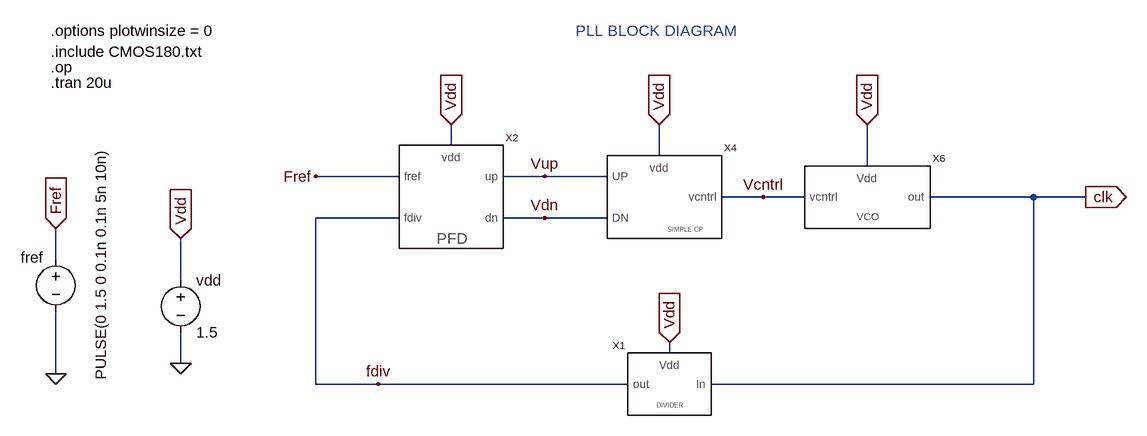
[diagram p0: schematic PLL_Complete.asc]
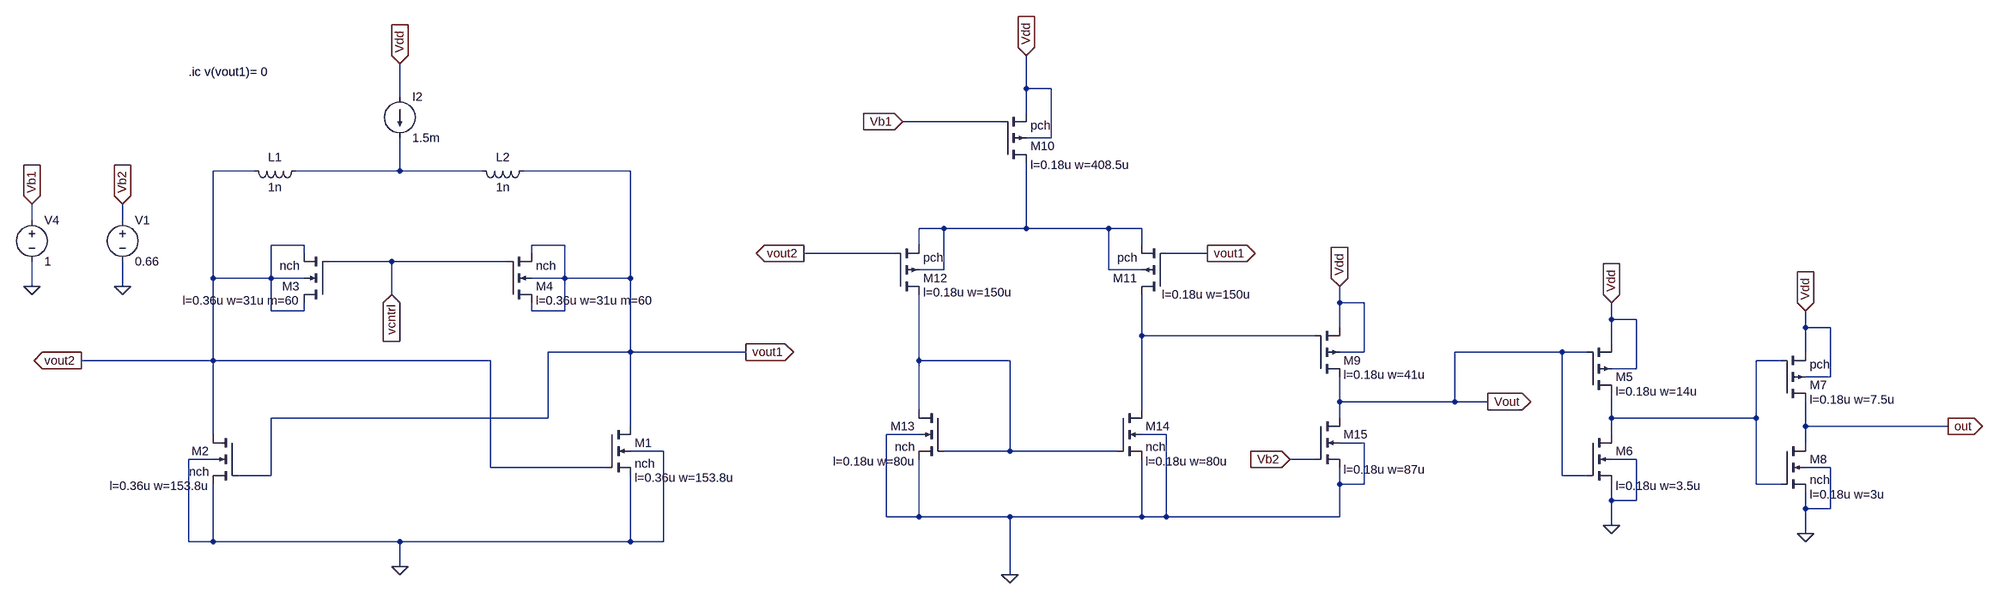
[diagram p1: sub-circuit vco_sym.asc]
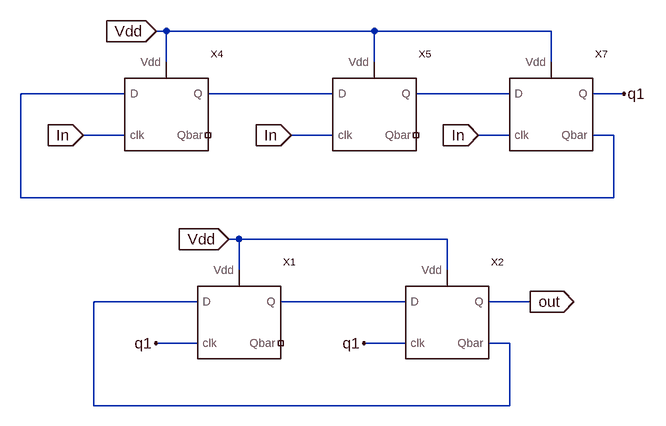
[diagram p2: sub-circuit divider_sym.asc]
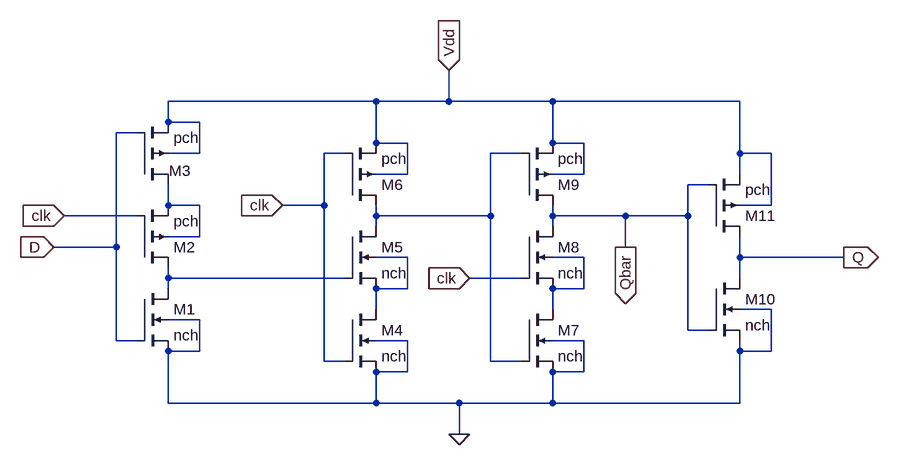
[diagram p3: sub-circuit dff_sym.asc]
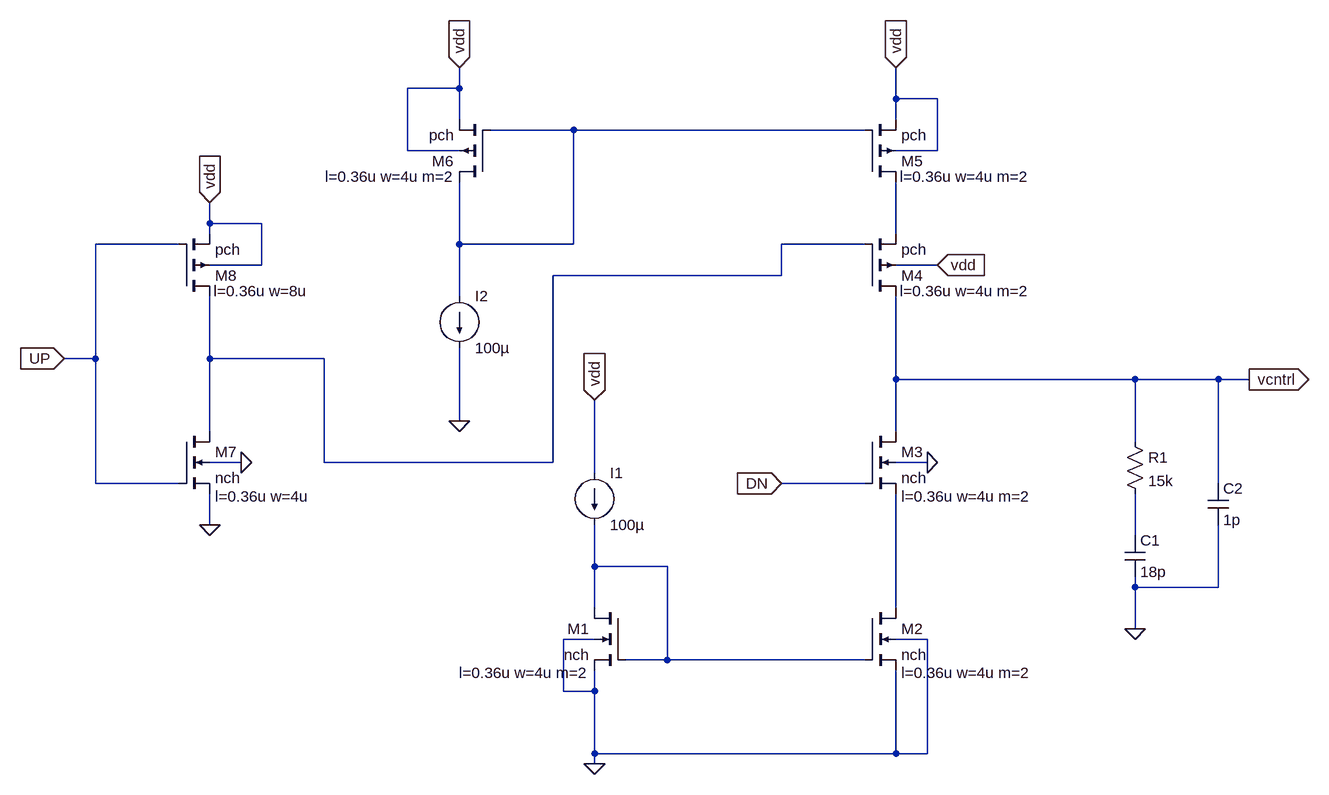
[diagram p4: sub-circuit simple_cp_sym.asc]
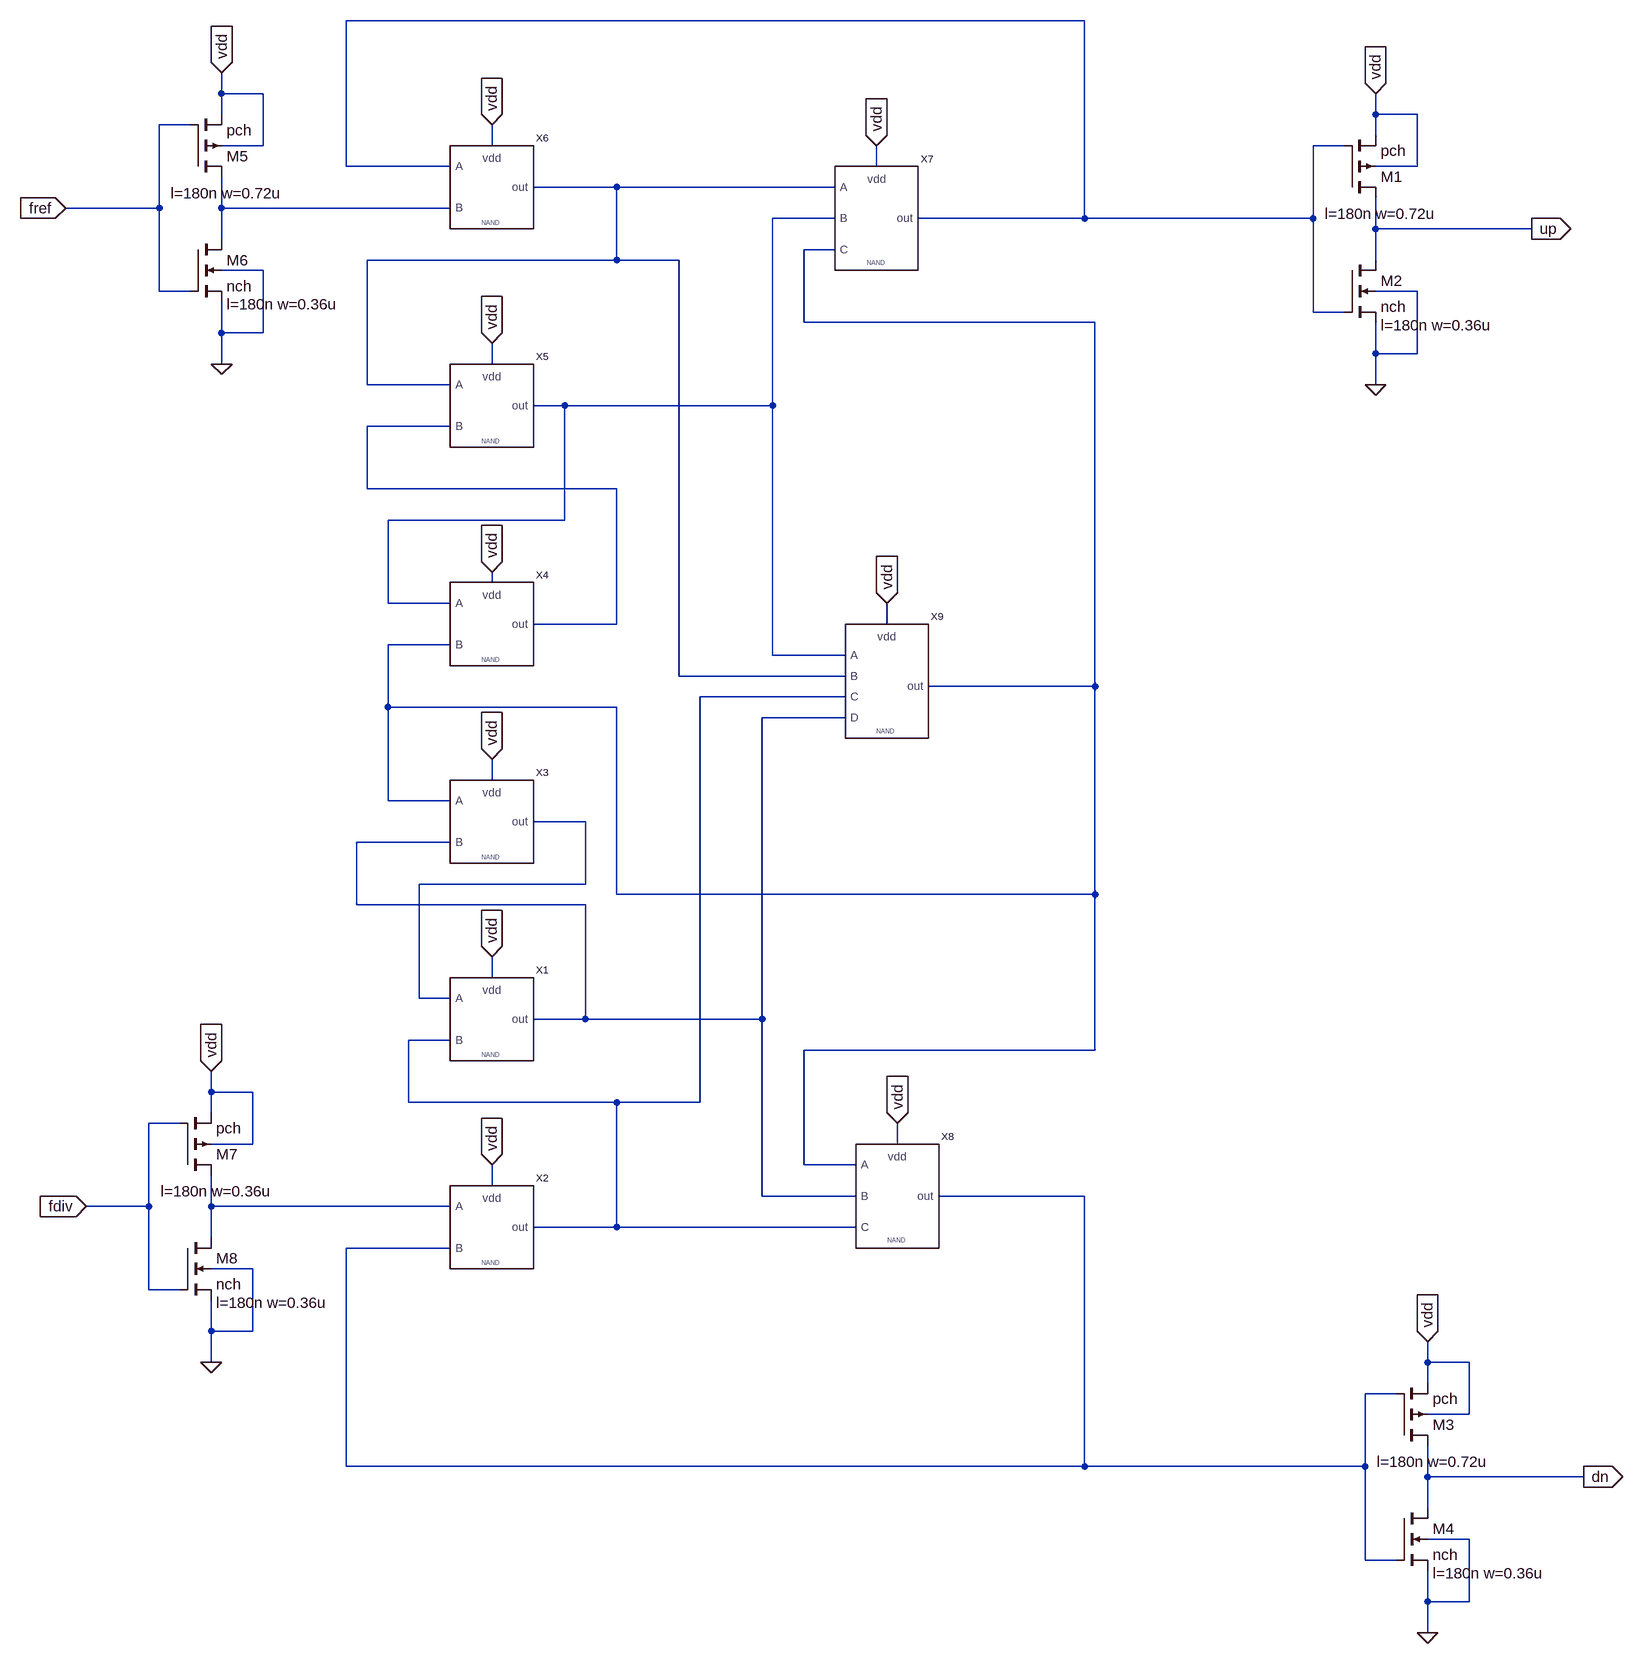
[diagram p5: sub-circuit pfd_nand.asc]
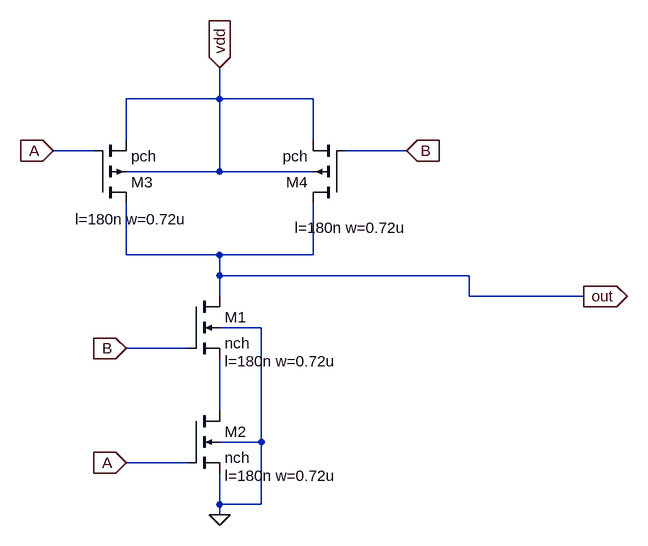
[diagram p6: sub-circuit nand_2.asc]
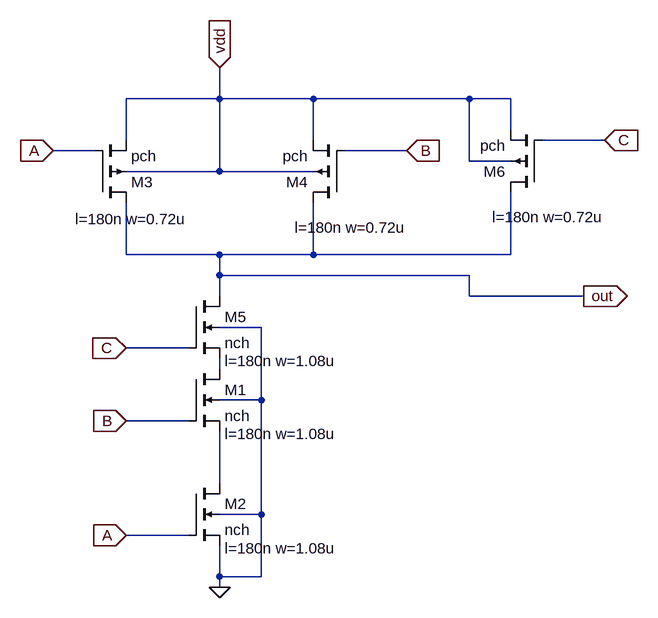
[diagram p7: sub-circuit nand_3.asc]
PLL_Complete.asc, the LTspice schematic file:
Version 4
SHEET 1 5428 1300
WIRE 592 -1072 592 -1104
WIRE 912 -1056 912 -1104
WIRE 1232 -1040 1232 -1104
WIRE 512 -1024 384 -1024
WIRE 736 -1024 672 -1024
WIRE 832 -1024 736 -1024
WIRE 1072 -992 1008 -992
WIRE 1136 -992 1072 -992
WIRE 1488 -992 1328 -992
WIRE 1568 -992 1488 -992
WIRE 512 -960 384 -960
WIRE 736 -960 672 -960
WIRE 832 -960 736 -960
WIRE -16 -896 -16 -944
WIRE 176 -864 176 -928
WIRE 928 -752 928 -768
WIRE 176 -736 176 -784
WIRE -16 -720 -16 -816
WIRE 384 -704 384 -960
WIRE 480 -704 384 -704
WIRE 864 -704 480 -704
WIRE 1488 -704 1488 -992
WIRE 1488 -704 992 -704
FLAG 176 -736 0
FLAG 176 -928 Vdd
IOPIN 176 -928 In
FLAG 1232 -1104 Vdd
IOPIN 1232 -1104 In
FLAG 928 -768 Vdd
IOPIN 928 -768 In
FLAG 1568 -992 clk
IOPIN 1568 -992 Out
FLAG -16 -720 0
FLAG -16 -944 Fref
IOPIN -16 -944 In
FLAG 912 -1104 Vdd
IOPIN 912 -1104 In
FLAG 384 -1024 Fref
FLAG 592 -1104 Vdd
IOPIN 592 -1104 In
FLAG 736 -1024 Vup
FLAG 736 -960 Vdn
FLAG 1072 -992 Vcntrl
FLAG 480 -704 fdiv
SYMBOL voltage 176 -880 R0
WINDOW 123 0 0 Left 0
WINDOW 39 0 0 Left 0
SYMATTR InstName vdd
SYMATTR Value 1.5
SYMBOL VCO_SYM 1232 -992 R0
SYMATTR InstName X6
SYMBOL DIVIDER_SYM 928 -704 M0
SYMATTR InstName X1
SYMBOL voltage -16 -912 R0
WINDOW 0 -54 13 Left 2
WINDOW 3 69 -156 VRight 2
WINDOW 123 0 0 Left 0
WINDOW 39 0 0 Left 0
SYMATTR InstName fref
SYMATTR Value PULSE(0 1.5 0 0.1n 0.1n 5n 10n)
SYMBOL simple_CP_sym 912 -992 R0
SYMATTR InstName X4
SYMBOL pfd_nand 592 -992 R0
SYMATTR InstName X2
TEXT -24 -1216 Left 2 !.include CMOS180.txt
TEXT -24 -1192 Left 2 !.op
TEXT -24 -1168 Left 2 !.tran 20u
TEXT -24 -1248 Left 2 !.options plotwinsize = 0
TEXT 784 -1248 Left 2 ;PLL BLOCK DIAGRAM

vco_sym.asc, the sub-circuit schematic file:
Version 4
SHEET 1 5428 1300
WIRE 1888 -656 1888 -720
WIRE 1936 -656 1888 -656
WIRE 672 -640 672 -704
WIRE 1888 -608 1888 -656
WIRE 1840 -592 1648 -592
WIRE 1936 -560 1936 -656
WIRE 1936 -560 1888 -560
WIRE 320 -496 240 -496
WIRE 672 -496 672 -560
WIRE 672 -496 400 -496
WIRE 832 -496 672 -496
WIRE 1120 -496 912 -496
WIRE -112 -400 -112 -432
WIRE 64 -400 64 -432
WIRE 1728 -384 1680 -384
WIRE 1888 -384 1888 -512
WIRE 1888 -384 1728 -384
WIRE 2048 -384 1888 -384
WIRE 2112 -384 2048 -384
WIRE 416 -352 352 -352
WIRE 992 -352 928 -352
WIRE 1680 -352 1680 -384
WIRE 2112 -352 2112 -384
WIRE 416 -336 416 -352
WIRE 928 -336 928 -352
WIRE 1632 -336 1456 -336
WIRE 2240 -336 2160 -336
WIRE 656 -320 464 -320
WIRE 880 -320 656 -320
WIRE 1728 -304 1728 -384
WIRE 1728 -304 1680 -304
WIRE 2048 -304 2048 -384
WIRE 2112 -304 2048 -304
WIRE 240 -288 240 -496
WIRE 352 -288 352 -352
WIRE 352 -288 240 -288
WIRE 416 -288 352 -288
WIRE 992 -288 992 -352
WIRE 992 -288 928 -288
WIRE 1120 -288 1120 -496
WIRE 1120 -288 992 -288
WIRE -112 -272 -112 -320
WIRE 64 -272 64 -320
WIRE 656 -256 656 -320
WIRE 2496 -240 2496 -272
WIRE 2544 -240 2496 -240
WIRE 352 -224 352 -288
WIRE 416 -224 416 -240
WIRE 416 -224 352 -224
WIRE 928 -224 928 -240
WIRE 992 -224 992 -288
WIRE 992 -224 928 -224
WIRE 3024 -208 3024 -240
WIRE 3072 -208 3024 -208
WIRE 2496 -192 2496 -240
WIRE 3424 -192 3424 -224
WIRE 3472 -192 3424 -192
WIRE 2112 -176 2112 -256
WIRE 2448 -176 2112 -176
WIRE 3024 -160 3024 -208
WIRE 1120 -144 1120 -288
WIRE 1120 -144 960 -144
WIRE 1344 -144 1120 -144
WIRE 2544 -144 2544 -240
WIRE 2544 -144 2496 -144
WIRE 2928 -144 2720 -144
WIRE 2976 -144 2928 -144
WIRE 3424 -144 3424 -192
WIRE 240 -128 240 -288
WIRE 240 -128 -16 -128
WIRE 848 -128 240 -128
WIRE 1680 -128 1680 -256
WIRE 1856 -128 1680 -128
WIRE 3376 -128 3328 -128
WIRE 3072 -112 3072 -208
WIRE 3072 -112 3024 -112
WIRE 3472 -96 3472 -192
WIRE 3472 -96 3424 -96
WIRE 2496 -48 2496 -96
WIRE 2720 -48 2720 -144
WIRE 2720 -48 2496 -48
WIRE 2784 -48 2720 -48
WIRE 1680 -32 1680 -128
WIRE 2112 -32 2112 -176
WIRE 960 -16 960 -144
WIRE 960 -16 352 -16
WIRE 2496 -16 2496 -48
WIRE 3024 -16 3024 -64
WIRE 3328 -16 3328 -128
WIRE 3328 -16 3024 -16
WIRE 1120 0 1120 -144
WIRE 3424 0 3424 -48
WIRE 3712 0 3424 0
WIRE 240 16 240 -128
WIRE 1680 16 1616 16
WIRE 2160 16 2112 16
WIRE 3024 16 3024 -16
WIRE 2544 32 2496 32
WIRE 3424 32 3424 0
WIRE 1184 48 1120 48
WIRE 1856 48 1856 -128
WIRE 1856 48 1728 48
WIRE 2064 48 1856 48
WIRE 240 64 192 64
WIRE 2448 64 2400 64
WIRE 3072 64 3024 64
WIRE 848 80 848 -128
WIRE 1072 80 848 80
WIRE 3472 80 3424 80
WIRE 352 96 352 -16
WIRE 352 96 288 96
WIRE 2928 96 2928 -144
WIRE 2976 96 2928 96
WIRE 2496 112 2496 80
WIRE 2544 112 2544 32
WIRE 2544 112 2496 112
WIRE 3328 112 3328 -16
WIRE 3376 112 3328 112
WIRE 3024 144 3024 112
WIRE 3072 144 3072 64
WIRE 3072 144 3024 144
WIRE 3424 160 3424 128
WIRE 3472 160 3472 80
WIRE 3472 160 3424 160
WIRE 1616 176 1616 16
WIRE 1680 176 1680 64
WIRE 1680 176 1616 176
WIRE 1856 176 1680 176
WIRE 2112 176 2112 64
WIRE 2112 176 1856 176
WIRE 2160 176 2160 16
WIRE 2160 176 2112 176
WIRE 2496 176 2496 112
WIRE 2496 176 2160 176
WIRE 3024 192 3024 144
WIRE 3424 208 3424 160
WIRE 192 224 192 64
WIRE 240 224 240 112
WIRE 240 224 192 224
WIRE 672 224 240 224
WIRE 1120 224 1120 96
WIRE 1120 224 672 224
WIRE 1184 224 1184 48
WIRE 1184 224 1120 224
WIRE 672 272 672 224
WIRE 1856 288 1856 176
FLAG 672 -704 Vdd
IOPIN 672 -704 In
FLAG 1344 -144 vout1
IOPIN 1344 -144 Out
FLAG 672 272 0
FLAG -16 -128 vout2
IOPIN -16 -128 Out
FLAG 656 -256 vcntrl
IOPIN 656 -256 In
FLAG 1856 288 0
FLAG -112 -272 0
FLAG 3024 192 0
FLAG 3424 208 0
FLAG 1888 -720 Vdd
IOPIN 1888 -720 In
FLAG 3024 -240 Vdd
IOPIN 3024 -240 In
FLAG 3424 -224 Vdd
IOPIN 3424 -224 In
FLAG 1456 -336 vout2
IOPIN 1456 -336 Out
FLAG 2496 -272 Vdd
IOPIN 2496 -272 In
FLAG 2240 -336 vout1
IOPIN 2240 -336 Out
FLAG 64 -272 0
FLAG -112 -432 Vb1
IOPIN -112 -432 In
FLAG 64 -432 Vb2
IOPIN 64 -432 In
FLAG 1648 -592 Vb1
IOPIN 1648 -592 In
FLAG 2400 64 Vb2
IOPIN 2400 64 In
FLAG 2784 -48 Vout
IOPIN 2784 -48 Out
FLAG 3712 0 out
IOPIN 3712 0 Out
SYMBOL nmos4 288 16 M0
WINDOW 123 56 100 Left 2
SYMATTR Value2 l=0.36u w=153.8u
SYMATTR InstName M2
SYMATTR Value nch
SYMBOL current 672 -640 R0
WINDOW 123 0 0 Left 0
WINDOW 39 0 0 Left 0
SYMATTR InstName I2
SYMATTR Value 1.5m
SYMBOL ind 416 -512 R90
WINDOW 0 5 56 VBottom 2
WINDOW 3 32 56 VTop 2
SYMATTR InstName L1
SYMATTR Value 1n
SYMATTR SpiceLine Rser=1.5
SYMBOL nmos4 1072 0 R0
WINDOW 123 56 100 Left 2
SYMATTR Value2 l=0.36u w=153.8u
SYMATTR InstName M1
SYMATTR Value nch
SYMBOL ind 928 -512 R90
WINDOW 0 5 56 VBottom 2
WINDOW 3 32 56 VTop 2
SYMATTR InstName L2
SYMATTR Value 1n
SYMATTR SpiceLine Rser=1.5
SYMBOL nmos4 464 -240 R180
WINDOW 123 56 4 Left 2
SYMATTR Value2 l=0.36u w=31u m=60
SYMATTR InstName M3
SYMATTR Value nch
SYMBOL nmos4 880 -240 M180
WINDOW 123 56 4 Left 2
SYMATTR Value2 l=0.36u w=31u m=60
SYMATTR InstName M4
SYMATTR Value nch
SYMBOL pmos4 1840 -512 M180
WINDOW 123 56 -4 Left 2
SYMATTR Value2 l=0.18u w=408.5u
SYMATTR InstName M10
SYMATTR Value pch
SYMBOL pmos4 2160 -256 R180
WINDOW 123 -164 0 Left 2
SYMATTR Value2 l=0.18u w=150u
SYMATTR InstName M11
SYMATTR Value pch
SYMBOL pmos4 1632 -256 M180
WINDOW 123 56 4 Left 2
SYMATTR Value2 l=0.18u w=150u
SYMATTR InstName M12
SYMATTR Value pch
SYMBOL voltage -112 -416 R0
WINDOW 123 0 0 Left 0
WINDOW 39 0 0 Left 0
SYMATTR InstName V4
SYMATTR Value 1
SYMBOL nmos4 1728 -32 M0
WINDOW 123 56 100 Left 2
SYMATTR Value2 l=0.18u w=80u
SYMATTR InstName M13
SYMATTR Value nch
SYMBOL nmos4 2064 -32 R0
WINDOW 123 56 100 Left 2
SYMATTR Value2 l=0.18u w=80u
SYMATTR InstName M14
SYMATTR Value nch
SYMBOL pmos4 2976 -64 M180
WINDOW 123 56 4 Left 2
WINDOW 3 56 72 Invisible 2
SYMATTR Value2 l=0.18u w=14u
SYMATTR Value pch
SYMATTR InstName M5
SYMBOL nmos4 2976 16 R0
WINDOW 123 56 100 Left 2
WINDOW 3 56 72 Invisible 2
SYMATTR Value2 l=0.18u w=3.5u
SYMATTR Value nch
SYMATTR InstName M6
SYMBOL pmos4 3376 -48 M180
WINDOW 123 56 4 Left 2
SYMATTR Value2 l=0.18u w=7.5u
SYMATTR InstName M7
SYMATTR Value pch
SYMBOL nmos4 3376 32 R0
WINDOW 123 56 100 Left 2
SYMATTR Value2 l=0.18u w=3u
SYMATTR InstName M8
SYMATTR Value nch
SYMBOL pmos4 2448 -96 M180
WINDOW 123 56 4 Left 2
WINDOW 3 56 72 Invisible 2
SYMATTR Value2 l=0.18u w=41u
SYMATTR Value pch
SYMATTR InstName M9
SYMBOL nmos4 2448 -16 R0
WINDOW 123 56 100 Left 2
WINDOW 3 56 72 Invisible 2
SYMATTR Value2 l=0.18u w=87u
SYMATTR Value nch
SYMATTR InstName M15
SYMBOL voltage 64 -416 R0
WINDOW 123 0 0 Left 0
WINDOW 39 0 0 Left 0
SYMATTR InstName V1
SYMATTR Value 0.66
TEXT 192 -688 Left 2 !.ic v(vout1)= 0

divider_sym.asc, the sub-circuit schematic file:
Version 4
SHEET 1 3140 684
WIRE -48 -176 -64 -176
WIRE 272 -176 -48 -176
WIRE 544 -176 272 -176
WIRE -48 -128 -48 -176
WIRE 272 -128 272 -176
WIRE 544 -128 544 -176
WIRE -112 -80 -272 -80
WIRE 208 -80 16 -80
WIRE 480 -80 336 -80
WIRE 656 -80 608 -80
WIRE -112 -16 -176 -16
WIRE 208 -16 144 -16
WIRE 480 -16 432 -16
WIRE 640 -16 608 -16
WIRE -272 80 -272 -80
WIRE 640 80 640 -16
WIRE 640 80 -272 80
WIRE 64 144 48 144
WIRE 384 144 64 144
WIRE 64 192 64 144
WIRE 384 192 384 144
WIRE 0 240 -160 240
WIRE 320 240 128 240
WIRE 512 240 448 240
WIRE 0 304 -64 304
WIRE 320 304 256 304
WIRE 480 304 448 304
WIRE -160 400 -160 240
WIRE 480 400 480 304
WIRE 480 400 -160 400
FLAG -64 -176 Vdd
IOPIN -64 -176 In
FLAG -176 -16 In
IOPIN -176 -16 In
FLAG 656 -80 q1
FLAG 48 144 Vdd
IOPIN 48 144 In
FLAG -64 304 q1
FLAG 512 240 out
IOPIN 512 240 Out
FLAG 256 304 q1
FLAG 144 -16 In
IOPIN 144 -16 In
FLAG 432 -16 In
IOPIN 432 -16 In
SYMBOL dff_sym -48 -48 R0
SYMATTR InstName X4
SYMBOL dff_sym 272 -48 R0
SYMATTR InstName X5
SYMBOL dff_sym 544 -48 R0
SYMATTR InstName X7
SYMBOL dff_sym 64 272 R0
SYMATTR InstName X1
SYMBOL dff_sym 384 272 R0
SYMATTR InstName X2

dff_sym.asc, the sub-circuit schematic file:
Version 4
SHEET 1 1948 680
WIRE 1056 -128 736 -128
WIRE 1168 -128 1168 -176
WIRE 1168 -128 1056 -128
WIRE 1328 -128 1168 -128
WIRE 1616 -128 1328 -128
WIRE 736 -96 736 -128
WIRE 784 -96 736 -96
WIRE 688 -80 656 -80
WIRE 1056 -64 1056 -128
WIRE 1104 -64 1056 -64
WIRE 1328 -64 1328 -128
WIRE 1376 -64 1328 -64
WIRE 784 -48 784 -96
WIRE 784 -48 736 -48
WIRE 1008 -48 976 -48
WIRE 1280 -48 1232 -48
WIRE 1616 -48 1616 -128
WIRE 1664 -48 1616 -48
WIRE 1104 -16 1104 -64
WIRE 1104 -16 1056 -16
WIRE 1376 -16 1376 -64
WIRE 1376 -16 1328 -16
WIRE 1616 -16 1616 -48
WIRE 1568 0 1536 0
WIRE 736 32 736 0
WIRE 784 32 736 32
WIRE 976 32 976 -48
WIRE 976 32 912 32
WIRE 1664 32 1664 -48
WIRE 1664 32 1616 32
WIRE 688 48 576 48
WIRE 1056 48 1056 32
WIRE 1232 48 1232 -48
WIRE 1232 48 1056 48
WIRE 1328 48 1328 32
WIRE 1440 48 1328 48
WIRE 1536 48 1536 0
WIRE 1536 48 1440 48
WIRE 1056 64 1056 48
WIRE 1328 64 1328 48
WIRE 784 80 784 32
WIRE 784 80 736 80
WIRE 656 96 656 -80
WIRE 656 96 560 96
WIRE 1440 96 1440 48
WIRE 1104 112 1056 112
WIRE 1376 112 1328 112
WIRE 1616 112 1616 80
WIRE 1776 112 1616 112
WIRE 736 144 736 128
WIRE 1008 144 736 144
WIRE 1280 144 1200 144
WIRE 1616 144 1616 112
WIRE 736 160 736 144
WIRE 1104 160 1104 112
WIRE 1104 160 1056 160
WIRE 1376 160 1376 112
WIRE 1376 160 1328 160
WIRE 1056 192 1056 160
WIRE 1328 192 1328 160
WIRE 1664 192 1616 192
WIRE 784 208 736 208
WIRE 1536 224 1536 48
WIRE 1568 224 1536 224
WIRE 656 240 656 96
WIRE 688 240 656 240
WIRE 1104 240 1056 240
WIRE 1376 240 1328 240
WIRE 784 256 784 208
WIRE 784 256 736 256
WIRE 1616 256 1616 240
WIRE 1664 256 1664 192
WIRE 1664 256 1616 256
WIRE 976 272 976 32
WIRE 1008 272 976 272
WIRE 1232 272 1232 48
WIRE 1280 272 1232 272
WIRE 1104 288 1104 240
WIRE 1104 288 1056 288
WIRE 1376 288 1376 240
WIRE 1376 288 1328 288
WIRE 736 336 736 256
WIRE 1056 336 1056 288
WIRE 1056 336 736 336
WIRE 1184 336 1056 336
WIRE 1328 336 1328 288
WIRE 1328 336 1184 336
WIRE 1616 336 1616 256
WIRE 1616 336 1328 336
WIRE 1184 384 1184 336
FLAG 576 48 clk
IOPIN 576 48 In
FLAG 1776 112 Q
IOPIN 1776 112 Out
FLAG 560 96 D
IOPIN 560 96 In
FLAG 912 32 clk
IOPIN 912 32 In
FLAG 1200 144 clk
IOPIN 1200 144 In
FLAG 1168 -176 Vdd
IOPIN 1168 -176 In
FLAG 1440 96 Qbar
IOPIN 1440 96 Out
FLAG 1184 384 0
SYMBOL pmos4 688 0 M180
WINDOW 0 49 21 Left 2
SYMATTR Value2 l=180n w=1.44u
SYMATTR InstName M3
SYMATTR Value pch
SYMBOL pmos4 1008 32 M180
SYMATTR Value2 l=180n w=0.72u
SYMATTR InstName M6
SYMATTR Value pch
SYMBOL pmos4 1280 32 M180
SYMATTR Value2 l=180n w=0.72u
SYMATTR InstName M9
SYMATTR Value pch
SYMBOL pmos4 1568 80 M180
SYMATTR Value2 l=180n w=0.72u
SYMATTR InstName M11
SYMATTR Value pch
SYMBOL pmos4 688 128 M180
SYMATTR Value2 l=180n w=1.44u
SYMATTR InstName M2
SYMATTR Value pch
SYMBOL nmos4 688 160 R0
SYMATTR Value2 l=180n w=0.36u
SYMATTR InstName M1
SYMATTR Value nch
SYMBOL nmos4 1008 64 R0
SYMATTR Value2 l=180n w=0.72u
SYMATTR InstName M5
SYMATTR Value nch
SYMBOL nmos4 1008 192 R0
SYMATTR Value2 l=180n w=0.72u
SYMATTR InstName M4
SYMATTR Value nch
SYMBOL nmos4 1280 64 R0
SYMATTR Value2 l=180n w=0.72u
SYMATTR InstName M8
SYMATTR Value nch
SYMBOL nmos4 1280 192 R0
SYMATTR Value2 l=180n w=0.72u
SYMATTR InstName M7
SYMATTR Value nch
SYMBOL nmos4 1568 144 R0
SYMATTR Value2 l=180n w=0.36u
SYMATTR InstName M10
SYMATTR Value nch

simple_cp_sym.asc, the sub-circuit schematic file:
Version 4
SHEET 1 1216 680
WIRE -128 -640 -128 -672
WIRE -128 -640 -208 -640
WIRE 544 -624 544 -672
WIRE 608 -624 544 -624
WIRE -128 -592 -128 -640
WIRE 544 -592 544 -624
WIRE 48 -576 -80 -576
WIRE 496 -576 48 -576
WIRE -208 -544 -208 -640
WIRE -128 -544 -208 -544
WIRE 608 -544 608 -624
WIRE 608 -544 544 -544
WIRE -512 -432 -512 -464
WIRE -432 -432 -512 -432
WIRE -512 -416 -512 -432
WIRE 544 -416 544 -496
WIRE -560 -400 -688 -400
WIRE -128 -400 -128 -496
WIRE 48 -400 48 -576
WIRE 48 -400 -128 -400
WIRE 496 -400 368 -400
WIRE -432 -368 -432 -432
WIRE -432 -368 -512 -368
WIRE 608 -368 544 -368
WIRE 368 -352 368 -400
WIRE 368 -352 16 -352
WIRE -128 -320 -128 -400
WIRE -688 -224 -688 -400
WIRE -688 -224 -736 -224
WIRE -512 -224 -512 -320
WIRE -336 -224 -512 -224
WIRE 544 -192 544 -320
WIRE 912 -192 544 -192
WIRE 1040 -192 912 -192
WIRE 1088 -192 1040 -192
WIRE -128 -128 -128 -240
WIRE -512 -112 -512 -224
WIRE 544 -112 544 -192
WIRE 912 -96 912 -192
WIRE -464 -64 -512 -64
WIRE -336 -64 -336 -224
WIRE 16 -64 16 -352
WIRE 16 -64 -336 -64
WIRE 592 -64 544 -64
WIRE 80 -48 80 -160
WIRE -688 -32 -688 -224
WIRE -560 -32 -688 -32
WIRE 496 -32 368 -32
WIRE 1040 -32 1040 -192
WIRE -512 32 -512 -16
WIRE 912 48 912 -16
WIRE 80 96 80 32
WIRE 192 96 80 96
WIRE 912 128 912 112
WIRE 1040 128 1040 32
WIRE 1040 128 912 128
WIRE 80 160 80 96
WIRE 544 160 544 -16
WIRE 912 192 912 128
WIRE 80 208 32 208
WIRE 592 208 544 208
WIRE 192 240 192 96
WIRE 192 240 128 240
WIRE 496 240 192 240
WIRE 32 288 32 208
WIRE 80 288 80 256
WIRE 80 288 32 288
WIRE 80 384 80 288
WIRE 544 384 544 256
WIRE 544 384 80 384
WIRE 592 384 592 208
WIRE 592 384 544 384
WIRE 80 400 80 384
FLAG 80 400 0
FLAG 80 -160 vdd
IOPIN 80 -160 In
FLAG 592 -64 0
FLAG -128 -128 0
FLAG 912 192 0
FLAG 1088 -192 vcntrl
IOPIN 1088 -192 Out
FLAG 368 -32 DN
IOPIN 368 -32 In
FLAG -464 -64 0
FLAG -512 -464 vdd
IOPIN -512 -464 In
FLAG -512 32 0
FLAG -736 -224 UP
IOPIN -736 -224 In
FLAG -128 -672 vdd
IOPIN -128 -672 In
FLAG 544 -672 vdd
IOPIN 544 -672 In
FLAG 608 -368 vdd
IOPIN 608 -368 In
SYMBOL nmos4 128 160 M0
WINDOW 123 56 100 Left 2
SYMATTR Value2 l=0.36u w=4u m=2
SYMATTR InstName M1
SYMATTR Value nch
SYMBOL current 80 -48 R0
WINDOW 123 0 0 Left 0
WINDOW 39 0 0 Left 0
SYMATTR InstName I1
SYMATTR Value 100µ
SYMBOL nmos4 496 160 R0
WINDOW 123 56 100 Left 2
SYMATTR Value2 l=0.36u w=4u m=2
SYMATTR InstName M2
SYMATTR Value nch
SYMBOL nmos4 496 -112 R0
WINDOW 123 56 100 Left 2
SYMATTR Value2 l=0.36u w=4u m=2
SYMATTR InstName M3
SYMATTR Value nch
SYMBOL pmos4 496 -320 M180
WINDOW 123 54 8 Left 2
SYMATTR Value2 l=0.36u w=4u m=2
SYMATTR InstName M4
SYMATTR Value pch
SYMBOL pmos4 496 -496 M180
WINDOW 123 54 8 Left 2
SYMATTR Value2 l=0.36u w=4u m=2
SYMATTR InstName M5
SYMATTR Value pch
SYMBOL pmos4 -80 -496 R180
WINDOW 123 54 8 Left 2
SYMATTR Value2 l=0.36u w=4u m=2
SYMATTR InstName M6
SYMATTR Value pch
SYMBOL current -128 -320 R0
WINDOW 123 0 0 Left 0
WINDOW 39 0 0 Left 0
SYMATTR InstName I2
SYMATTR Value 100µ
SYMBOL res 896 -112 R0
SYMATTR InstName R1
SYMATTR Value 15k
SYMBOL cap 896 48 R0
SYMATTR InstName C1
SYMATTR Value 18p
SYMBOL cap 1024 -32 R0
SYMATTR InstName C2
SYMATTR Value 1p
SYMBOL nmos4 -560 -112 R0
WINDOW 123 56 100 Left 2
SYMATTR Value2 l=0.36u w=4u
SYMATTR InstName M7
SYMATTR Value nch
SYMBOL pmos4 -560 -320 M180
WINDOW 123 54 8 Left 2
SYMATTR Value2 l=0.36u w=8u
SYMATTR InstName M8
SYMATTR Value pch

pfd_nand.asc, the sub-circuit schematic file:
Version 4
SHEET 1 1908 1336
WIRE 1040 -1168 -96 -1168
WIRE -288 -1056 -288 -1088
WIRE -224 -1056 -288 -1056
WIRE -288 -1024 -288 -1056
WIRE 1488 -1024 1488 -1056
WIRE 1552 -1024 1488 -1024
WIRE -336 -1008 -384 -1008
WIRE 1488 -992 1488 -1024
WIRE -224 -976 -224 -1056
WIRE -224 -976 -288 -976
WIRE 128 -976 128 -1008
WIRE 1440 -976 1392 -976
WIRE -96 -944 -96 -1168
WIRE 64 -944 -96 -944
WIRE 720 -944 720 -976
WIRE 1552 -944 1552 -1024
WIRE 1552 -944 1488 -944
WIRE 320 -912 192 -912
WIRE 656 -912 320 -912
WIRE -384 -880 -384 -1008
WIRE -384 -880 -528 -880
WIRE -288 -880 -288 -928
WIRE 64 -880 -288 -880
WIRE 656 -864 560 -864
WIRE 1040 -864 1040 -1168
WIRE 1040 -864 784 -864
WIRE 1392 -864 1392 -976
WIRE 1392 -864 1040 -864
WIRE 1488 -848 1488 -896
WIRE 1728 -848 1488 -848
WIRE -288 -832 -288 -880
WIRE 656 -816 608 -816
WIRE 320 -800 320 -912
WIRE 320 -800 -64 -800
WIRE 416 -800 320 -800
WIRE 1488 -800 1488 -848
WIRE -224 -784 -288 -784
WIRE -384 -752 -384 -880
WIRE -336 -752 -384 -752
WIRE 1552 -752 1488 -752
WIRE 1392 -720 1392 -864
WIRE 1440 -720 1392 -720
WIRE 608 -704 608 -816
WIRE 1056 -704 608 -704
WIRE -288 -688 -288 -736
WIRE -224 -688 -224 -784
WIRE -224 -688 -288 -688
WIRE 1488 -656 1488 -704
WIRE 1552 -656 1552 -752
WIRE 1552 -656 1488 -656
WIRE -288 -640 -288 -688
WIRE 128 -640 128 -672
WIRE -64 -608 -64 -800
WIRE 64 -608 -64 -608
WIRE 1488 -608 1488 -656
WIRE 240 -576 192 -576
WIRE 560 -576 560 -864
WIRE 560 -576 240 -576
WIRE 64 -544 -64 -544
WIRE -64 -448 -64 -544
WIRE 320 -448 -64 -448
WIRE 240 -400 240 -576
WIRE 240 -400 -32 -400
WIRE 128 -304 128 -320
WIRE -32 -272 -32 -400
WIRE 64 -272 -32 -272
WIRE 320 -240 320 -448
WIRE 320 -240 192 -240
WIRE 736 -240 736 -272
WIRE 64 -208 -32 -208
WIRE 560 -192 560 -576
WIRE 672 -192 560 -192
WIRE 416 -160 416 -800
WIRE 672 -160 416 -160
WIRE 1056 -144 1056 -704
WIRE 1056 -144 800 -144
WIRE 672 -128 448 -128
WIRE -32 -112 -32 -208
WIRE 320 -112 -32 -112
WIRE 672 -96 544 -96
WIRE 128 0 128 -32
WIRE -32 32 -32 -112
WIRE 64 32 -32 32
WIRE 272 64 192 64
WIRE 64 96 -80 96
WIRE 272 160 272 64
WIRE 272 160 16 160
WIRE 320 176 320 -112
WIRE 1056 176 1056 -144
WIRE 1056 176 320 176
WIRE -80 192 -80 96
WIRE 272 192 -80 192
WIRE 128 304 128 272
WIRE 16 336 16 160
WIRE 64 336 16 336
WIRE 272 368 272 192
WIRE 272 368 192 368
WIRE 544 368 544 -96
WIRE 544 368 272 368
WIRE 64 400 0 400
WIRE 1056 416 1056 176
WIRE 1056 416 608 416
WIRE -304 480 -304 448
WIRE -240 480 -304 480
WIRE 0 496 0 400
WIRE 320 496 0 496
WIRE 448 496 448 -128
WIRE 448 496 320 496
WIRE -304 512 -304 480
WIRE -352 528 -400 528
WIRE -240 560 -240 480
WIRE -240 560 -304 560
WIRE 752 560 752 528
WIRE 608 592 608 416
WIRE 688 592 608 592
WIRE 128 624 128 592
WIRE 544 640 544 368
WIRE 688 640 544 640
WIRE 1040 640 816 640
WIRE -400 656 -400 528
WIRE -400 656 -496 656
WIRE -304 656 -304 608
WIRE 64 656 -304 656
WIRE 320 688 320 496
WIRE 320 688 192 688
WIRE 688 688 320 688
WIRE -304 704 -304 656
WIRE 64 720 -96 720
WIRE -240 752 -304 752
WIRE -400 784 -400 656
WIRE -352 784 -400 784
WIRE -304 848 -304 800
WIRE -240 848 -240 752
WIRE -240 848 -304 848
WIRE -304 896 -304 848
WIRE 1568 896 1568 864
WIRE 1632 896 1568 896
WIRE 1568 928 1568 896
WIRE 1520 944 1472 944
WIRE 1632 976 1632 896
WIRE 1632 976 1568 976
WIRE -96 1056 -96 720
WIRE 1040 1056 1040 640
WIRE 1040 1056 -96 1056
WIRE 1472 1056 1472 944
WIRE 1472 1056 1040 1056
WIRE 1568 1072 1568 1024
WIRE 1808 1072 1568 1072
WIRE 1568 1120 1568 1072
WIRE 1632 1168 1568 1168
WIRE 1472 1200 1472 1056
WIRE 1520 1200 1472 1200
WIRE 1568 1264 1568 1216
WIRE 1632 1264 1632 1168
WIRE 1632 1264 1568 1264
WIRE 1568 1312 1568 1264
FLAG 128 -1008 vdd
IOPIN 128 -1008 In
FLAG 128 -672 vdd
IOPIN 128 -672 In
FLAG 128 -320 vdd
IOPIN 128 -320 In
FLAG 128 -32 vdd
IOPIN 128 -32 In
FLAG 128 272 vdd
IOPIN 128 272 In
FLAG 128 592 vdd
IOPIN 128 592 In
FLAG 720 -976 vdd
IOPIN 720 -976 In
FLAG 736 -272 vdd
IOPIN 736 -272 In
FLAG 752 528 vdd
IOPIN 752 528 In
FLAG 1488 -1056 vdd
IOPIN 1488 -1056 In
FLAG 1488 -608 0
FLAG 1728 -848 up
IOPIN 1728 -848 Out
FLAG 1568 864 vdd
IOPIN 1568 864 In
FLAG 1568 1312 0
FLAG 1808 1072 dn
IOPIN 1808 1072 Out
FLAG -288 -1088 vdd
IOPIN -288 -1088 In
FLAG -288 -640 0
FLAG -528 -880 fref
IOPIN -528 -880 In
FLAG -304 448 vdd
IOPIN -304 448 In
FLAG -304 896 0
FLAG -496 656 fdiv
IOPIN -496 656 In
SYMBOL NAND_2 128 368 R0
SYMATTR InstName X1
SYMBOL NAND_2 128 688 R0
SYMATTR InstName X2
SYMBOL NAND_2 128 64 R0
SYMATTR InstName X3
SYMBOL NAND_2 128 -240 R0
SYMATTR InstName X4
SYMBOL NAND_2 128 -576 R0
SYMATTR InstName X5
SYMBOL NAND_2 128 -912 R0
SYMATTR InstName X6
SYMBOL NAND_3 720 -864 R0
SYMATTR InstName X7
SYMBOL NAND_3 752 640 R0
SYMATTR InstName X8
SYMBOL NAND_4 736 -144 R0
SYMATTR InstName X9
SYMBOL pmos4 1440 -896 M180
WINDOW 123 -30 -25 Left 2
SYMATTR Value2 l=180n w=0.72u
SYMATTR InstName M1
SYMATTR Value pch
SYMBOL nmos4 1440 -800 R0
WINDOW 123 56 100 Left 2
SYMATTR Value2 l=180n w=0.36u
SYMATTR InstName M2
SYMATTR Value nch
SYMBOL pmos4 1520 1024 M180
WINDOW 123 -30 -25 Left 2
SYMATTR Value2 l=180n w=0.72u
SYMATTR InstName M3
SYMATTR Value pch
SYMBOL nmos4 1520 1120 R0
WINDOW 123 56 100 Left 2
SYMATTR Value2 l=180n w=0.36u
SYMATTR InstName M4
SYMATTR Value nch
SYMBOL pmos4 -336 -928 M180
WINDOW 123 -30 -25 Left 2
SYMATTR Value2 l=180n w=0.72u
SYMATTR InstName M5
SYMATTR Value pch
SYMBOL nmos4 -336 -832 R0
WINDOW 123 56 100 Left 2
SYMATTR Value2 l=180n w=0.36u
SYMATTR InstName M6
SYMATTR Value nch
SYMBOL pmos4 -352 608 M180
WINDOW 123 -30 -25 Left 2
SYMATTR Value2 l=180n w=0.36u
SYMATTR InstName M7
SYMATTR Value pch
SYMBOL nmos4 -352 704 R0
WINDOW 123 56 100 Left 2
SYMATTR Value2 l=180n w=0.36u
SYMATTR InstName M8
SYMATTR Value nch

nand_2.asc, the sub-circuit schematic file:
Version 4
SHEET 1 1640 724
WIRE 544 64 544 16
WIRE 544 64 400 64
WIRE 688 64 544 64
WIRE 400 128 400 64
WIRE 688 128 688 64
WIRE 352 144 288 144
WIRE 832 144 736 144
WIRE 544 176 544 64
WIRE 544 176 400 176
WIRE 688 176 544 176
WIRE 400 304 400 224
WIRE 544 304 400 304
WIRE 688 304 688 224
WIRE 688 304 544 304
WIRE 544 336 544 304
WIRE 928 336 544 336
WIRE 544 368 544 336
WIRE 928 368 928 336
WIRE 1104 368 928 368
WIRE 608 416 544 416
WIRE 496 448 400 448
WIRE 544 544 544 464
WIRE 608 592 608 416
WIRE 608 592 544 592
WIRE 496 624 400 624
WIRE 544 688 544 640
WIRE 608 688 608 592
WIRE 608 688 544 688
WIRE 544 704 544 688
FLAG 1104 368 out
IOPIN 1104 368 Out
FLAG 544 704 0
FLAG 544 16 vdd
IOPIN 544 16 In
FLAG 288 144 A
IOPIN 288 144 In
FLAG 400 624 A
IOPIN 400 624 In
FLAG 400 448 B
IOPIN 400 448 In
FLAG 832 144 B
IOPIN 832 144 In
SYMBOL nmos4 496 544 R0
WINDOW 123 56 100 Left 2
SYMATTR Value2 l=180n w=0.72u
SYMATTR InstName M2
SYMATTR Value nch
SYMBOL nmos4 496 368 R0
WINDOW 123 56 100 Left 2
SYMATTR Value2 l=180n w=0.72u
SYMATTR InstName M1
SYMATTR Value nch
SYMBOL pmos4 352 224 M180
WINDOW 123 -30 -25 Left 2
SYMATTR Value2 l=180n w=0.72u
SYMATTR InstName M3
SYMATTR Value pch
SYMBOL pmos4 736 224 R180
WINDOW 123 -96 -38 Left 2
SYMATTR Value2 l=180n w=0.72u
SYMATTR InstName M4
SYMATTR Value pch

nand_3.asc, the sub-circuit schematic file:
Version 4
SHEET 1 1640 836
WIRE 544 64 544 16
WIRE 544 64 400 64
WIRE 688 64 544 64
WIRE 928 64 688 64
WIRE 992 64 928 64
WIRE 992 112 992 64
WIRE 400 128 400 64
WIRE 688 128 688 64
WIRE 1136 128 1040 128
WIRE 352 144 288 144
WIRE 832 144 736 144
WIRE 928 160 928 64
WIRE 992 160 928 160
WIRE 544 176 544 64
WIRE 544 176 400 176
WIRE 688 176 544 176
WIRE 400 304 400 224
WIRE 544 304 400 304
WIRE 688 304 688 224
WIRE 688 304 544 304
WIRE 992 304 992 208
WIRE 992 304 688 304
WIRE 544 336 544 304
WIRE 928 336 544 336
WIRE 544 368 544 336
WIRE 928 368 928 336
WIRE 1104 368 928 368
WIRE 608 416 544 416
WIRE 496 448 400 448
WIRE 544 480 544 464
WIRE 608 528 608 416
WIRE 608 528 544 528
WIRE 496 560 400 560
WIRE 544 656 544 576
WIRE 608 704 608 528
WIRE 608 704 544 704
WIRE 496 736 400 736
WIRE 544 800 544 752
WIRE 608 800 608 704
WIRE 608 800 544 800
WIRE 544 816 544 800
FLAG 1104 368 out
IOPIN 1104 368 Out
FLAG 544 816 0
FLAG 544 16 vdd
IOPIN 544 16 In
FLAG 288 144 A
IOPIN 288 144 In
FLAG 400 736 A
IOPIN 400 736 In
FLAG 400 560 B
IOPIN 400 560 In
FLAG 832 144 B
IOPIN 832 144 In
FLAG 400 448 C
IOPIN 400 448 In
FLAG 1136 128 C
IOPIN 1136 128 In
SYMBOL nmos4 496 656 R0
WINDOW 123 56 100 Left 2
SYMATTR Value2 l=180n w=1.08u
SYMATTR InstName M2
SYMATTR Value nch
SYMBOL nmos4 496 480 R0
WINDOW 123 56 100 Left 2
SYMATTR Value2 l=180n w=1.08u
SYMATTR InstName M1
SYMATTR Value nch
SYMBOL pmos4 352 224 M180
WINDOW 123 -30 -25 Left 2
SYMATTR Value2 l=180n w=0.72u
SYMATTR InstName M3
SYMATTR Value pch
SYMBOL pmos4 736 224 R180
WINDOW 123 -96 -38 Left 2
SYMATTR Value2 l=180n w=0.72u
SYMATTR InstName M4
SYMATTR Value pch
SYMBOL nmos4 496 368 R0
WINDOW 123 56 100 Left 2
SYMATTR Value2 l=180n w=1.08u
SYMATTR InstName M5
SYMATTR Value nch
SYMBOL pmos4 1040 208 R180
WINDOW 123 -96 -38 Left 2
SYMATTR Value2 l=180n w=0.72u
SYMATTR InstName M6
SYMATTR Value pch

nand_4.asc, the sub-circuit schematic file:
Version 4
SHEET 1 1952 964
WIRE 544 64 544 16
WIRE 544 64 400 64
WIRE 688 64 544 64
WIRE 928 64 688 64
WIRE 992 64 928 64
WIRE 1248 64 992 64
WIRE 1312 64 1248 64
WIRE 992 112 992 64
WIRE 1312 112 1312 64
WIRE 400 128 400 64
WIRE 688 128 688 64
WIRE 1136 128 1040 128
WIRE 1456 128 1360 128
WIRE 352 144 288 144
WIRE 832 144 736 144
WIRE 928 160 928 64
WIRE 992 160 928 160
WIRE 1248 160 1248 64
WIRE 1312 160 1248 160
WIRE 544 176 544 64
WIRE 544 176 400 176
WIRE 688 176 544 176
WIRE 400 304 400 224
WIRE 544 304 400 304
WIRE 688 304 688 224
WIRE 688 304 544 304
WIRE 992 304 992 208
WIRE 992 304 688 304
WIRE 1312 304 1312 208
WIRE 1312 304 992 304
WIRE 544 336 544 304
WIRE 928 336 544 336
WIRE 544 368 544 336
WIRE 608 416 544 416
WIRE 496 448 400 448
WIRE 544 496 544 464
WIRE 608 544 608 416
WIRE 608 544 544 544
WIRE 496 576 400 576
WIRE 928 576 928 336
WIRE 1712 576 928 576
WIRE 544 608 544 592
WIRE 1712 608 1712 576
WIRE 1856 608 1712 608
WIRE 608 656 608 544
WIRE 608 656 544 656
WIRE 496 688 400 688
WIRE 544 784 544 704
WIRE 608 832 608 656
WIRE 608 832 544 832
WIRE 496 864 400 864
WIRE 544 928 544 880
WIRE 608 928 608 832
WIRE 608 928 544 928
WIRE 544 944 544 928
FLAG 1856 608 out
IOPIN 1856 608 Out
FLAG 544 944 0
FLAG 544 16 vdd
IOPIN 544 16 In
FLAG 288 144 A
IOPIN 288 144 In
FLAG 400 864 A
IOPIN 400 864 In
FLAG 400 688 B
IOPIN 400 688 In
FLAG 832 144 B
IOPIN 832 144 In
FLAG 400 576 C
IOPIN 400 576 In
FLAG 1136 128 C
IOPIN 1136 128 In
FLAG 400 448 D
IOPIN 400 448 In
FLAG 1456 128 D
IOPIN 1456 128 In
SYMBOL nmos4 496 784 R0
WINDOW 123 56 100 Left 2
SYMATTR Value2 l=180n w=1.44u
SYMATTR InstName M2
SYMATTR Value nch
SYMBOL nmos4 496 608 R0
WINDOW 123 56 100 Left 2
SYMATTR Value2 l=180n w=1.44u
SYMATTR InstName M1
SYMATTR Value nch
SYMBOL pmos4 352 224 M180
WINDOW 123 -30 -25 Left 2
SYMATTR Value2 l=180n w=0.72u
SYMATTR InstName M3
SYMATTR Value pch
SYMBOL pmos4 736 224 R180
WINDOW 123 -96 -38 Left 2
SYMATTR Value2 l=180n w=0.72u
SYMATTR InstName M4
SYMATTR Value pch
SYMBOL nmos4 496 496 R0
WINDOW 123 56 100 Left 2
SYMATTR Value2 l=180n w=1.44u
SYMATTR InstName M5
SYMATTR Value nch
SYMBOL pmos4 1040 208 R180
WINDOW 123 -96 -38 Left 2
SYMATTR Value2 l=180n w=0.72u
SYMATTR InstName M6
SYMATTR Value pch
SYMBOL nmos4 496 368 R0
WINDOW 123 56 100 Left 2
SYMATTR Value2 l=180n w=1.44u
SYMATTR InstName M7
SYMATTR Value nch
SYMBOL pmos4 1360 208 R180
WINDOW 123 -96 -38 Left 2
SYMATTR Value2 l=180n w=0.72u
SYMATTR InstName M8
SYMATTR Value pch

The netlist it stands for:
* PLL_Complete.asc
vdd Vdd 0 1.5
XX6 Vcntrl Vdd clk vco_sym
XX1 clk Vdd fdiv divider_sym
V§fref Fref 0 PULSE(0 1.5 0 0.1n 0.1n 5n 10n)
XX4 Vdn Vup Vdd Vcntrl simple_cp_sym
XX2 Fref fdiv Vdd Vdn Vup pfd_nand

* block symbol definitions
.subckt vco_sym vcntrl Vdd out
M2 vout2 vout1 0 0 nch l=0.36u w=153.8u
I2 Vdd N001 1.5m
L1 N001 vout2 1n Rser=1.5
M1 vout1 vout2 0 0 nch l=0.36u w=153.8u
L2 vout1 N001 1n Rser=1.5
M3 vout2 vcntrl vout2 vout2 nch l=0.36u w=31u m=60
M4 vout1 vcntrl vout1 vout1 nch l=0.36u w=31u m=60
M10 N002 Vb1 Vdd Vdd pch l=0.18u w=408.5u
M11 N003 vout1 N002 N002 pch l=0.18u w=150u
M12 N004 vout2 N002 N002 pch l=0.18u w=150u
V4 Vb1 0 1
M13 N004 N004 0 0 nch l=0.18u w=80u
M14 N003 N004 0 0 nch l=0.18u w=80u
M5 N005 Vout Vdd Vdd pch l=0.18u w=14u
M6 N005 Vout 0 0 nch l=0.18u w=3.5u
M7 out N005 Vdd Vdd pch l=0.18u w=7.5u
M8 out N005 0 0 nch l=0.18u w=3u
M9 Vout N003 Vdd Vdd pch l=0.18u w=41u
M15 Vout Vb2 0 0 nch l=0.18u w=87u
V1 Vb2 0 0.66
.ic v(vout1)= 0
.ends vco_sym

.subckt divider_sym In Vdd out
XX4 In N001 Vdd N002 NC_01 dff_sym
XX5 In N002 Vdd N003 NC_02 dff_sym
XX7 In N003 Vdd q1 N001 dff_sym
XX1 q1 N004 Vdd N005 NC_03 dff_sym
XX2 q1 N005 Vdd out N004 dff_sym
.ends divider_sym

.subckt dff_sym clk D Vdd Q Qbar
M3 N002 D Vdd Vdd pch l=180n w=1.44u
M6 N001 clk Vdd Vdd pch l=180n w=0.72u
M9 Qbar N001 Vdd Vdd pch l=180n w=0.72u
M11 Q Qbar Vdd Vdd pch l=180n w=0.72u
M2 N005 clk N002 N002 pch l=180n w=1.44u
M1 N005 D 0 0 nch l=180n w=0.36u
M5 N001 N005 N003 N003 nch l=180n w=0.72u
M4 N003 clk 0 0 nch l=180n w=0.72u
M8 Qbar clk N004 N004 nch l=180n w=0.72u
M7 N004 N001 0 0 nch l=180n w=0.72u
M10 Q Qbar 0 0 nch l=180n w=0.36u
.ends dff_sym

.subckt simple_cp_sym DN UP vdd vcntrl
M1 N005 N005 0 0 nch l=0.36u w=4u m=2
I1 vdd N005 100µ
M2 N006 N005 0 0 nch l=0.36u w=4u m=2
M3 vcntrl DN N006 0 nch l=0.36u w=4u m=2
M4 vcntrl N003 N002 vdd pch l=0.36u w=4u m=2
M5 N002 N001 vdd vdd pch l=0.36u w=4u m=2
M6 N001 N001 vdd vdd pch l=0.36u w=4u m=2
I2 N001 0 100µ
R1 vcntrl N004 15k
C1 N004 0 18p
C2 vcntrl 0 1p
M7 N003 UP 0 0 nch l=0.36u w=4u
M8 N003 UP vdd vdd pch l=0.36u w=8u
.ends simple_cp_sym

.subckt pfd_nand fref fdiv vdd dn up
XX1 N009 N007 vdd N008 nand_2
XX2 N011 N010 vdd N007 nand_2
XX3 N005 N008 vdd N009 nand_2
XX4 N004 N005 vdd N006 nand_2
XX5 N002 N006 vdd N004 nand_2
XX6 N001 N003 vdd N002 nand_2
XX7 N002 N004 N005 vdd N001 nand_3
XX8 N005 N008 N007 vdd N010 nand_3
XX9 N004 N002 N007 N008 vdd N005 nand_4
M1 up N001 vdd vdd pch l=180n w=0.72u
M2 up N001 0 0 nch l=180n w=0.36u
M3 dn N010 vdd vdd pch l=180n w=0.72u
M4 dn N010 0 0 nch l=180n w=0.36u
M5 N003 fref vdd vdd pch l=180n w=0.72u
M6 N003 fref 0 0 nch l=180n w=0.36u
M7 N011 fdiv vdd vdd pch l=180n w=0.36u
M8 N011 fdiv 0 0 nch l=180n w=0.36u
.ends pfd_nand

.subckt nand_2 A B vdd out
M2 N001 A 0 0 nch l=180n w=0.72u
M1 out B N001 0 nch l=180n w=0.72u
M3 out A vdd vdd pch l=180n w=0.72u
M4 out B vdd vdd pch l=180n w=0.72u
.ends nand_2

.subckt nand_3 A B C vdd out
M2 N002 A 0 0 nch l=180n w=1.08u
M1 N001 B N002 0 nch l=180n w=1.08u
M3 out A vdd vdd pch l=180n w=0.72u
M4 out B vdd vdd pch l=180n w=0.72u
M5 out C N001 0 nch l=180n w=1.08u
M6 out C vdd vdd pch l=180n w=0.72u
.ends nand_3

.subckt nand_4 A B C D vdd out
M2 N003 A 0 0 nch l=180n w=1.44u
M1 N002 B N003 0 nch l=180n w=1.44u
M3 out A vdd vdd pch l=180n w=0.72u
M4 out B vdd vdd pch l=180n w=0.72u
M5 N001 C N002 0 nch l=180n w=1.44u
M6 out C vdd vdd pch l=180n w=0.72u
M7 out D N001 0 nch l=180n w=1.44u
M8 out D vdd vdd pch l=180n w=0.72u
.ends nand_4

.model NMOS NMOS
.model PMOS PMOS
.lib standard.mos
.include CMOS180.txt
.op
.tran 20u
.options plotwinsize = 0
* PLL BLOCK DIAGRAM
.backanno
.end

* Results of the author's LTspice run, read from the files saved beside the schematic
* Operating Point, zero values left out:
*   V(vdd) = 1.5 V
*   V(vcntrl) = 26.15 nV
*   V(clk) = 1.5 V
*   V(fdiv) = 1.498 V
*   V(vdn) = 1.5 V
*   V(vup) = 5.259 nV
*   I(Vdd) = -4.341 mA
*   Ix(x6:VDD) = 4.139 mA
*   Ix(x1:VDD) = 1.622 µA
*   Ix(x4:VDD) = 200 µA
*   Ix(x2:VDD) = 124.5 pA